# EasyEDA Pro project PCB.epro, schematic Schematic1
Board Name: Board1; Create Date: 2026-03-10; Page Name: P1; Project Name: Hyper Pi; Schematic Name: Schematic1; Update Date: 2026-03-16; Company: EasyEDA.com; Page Size: A4; Version: V1.0
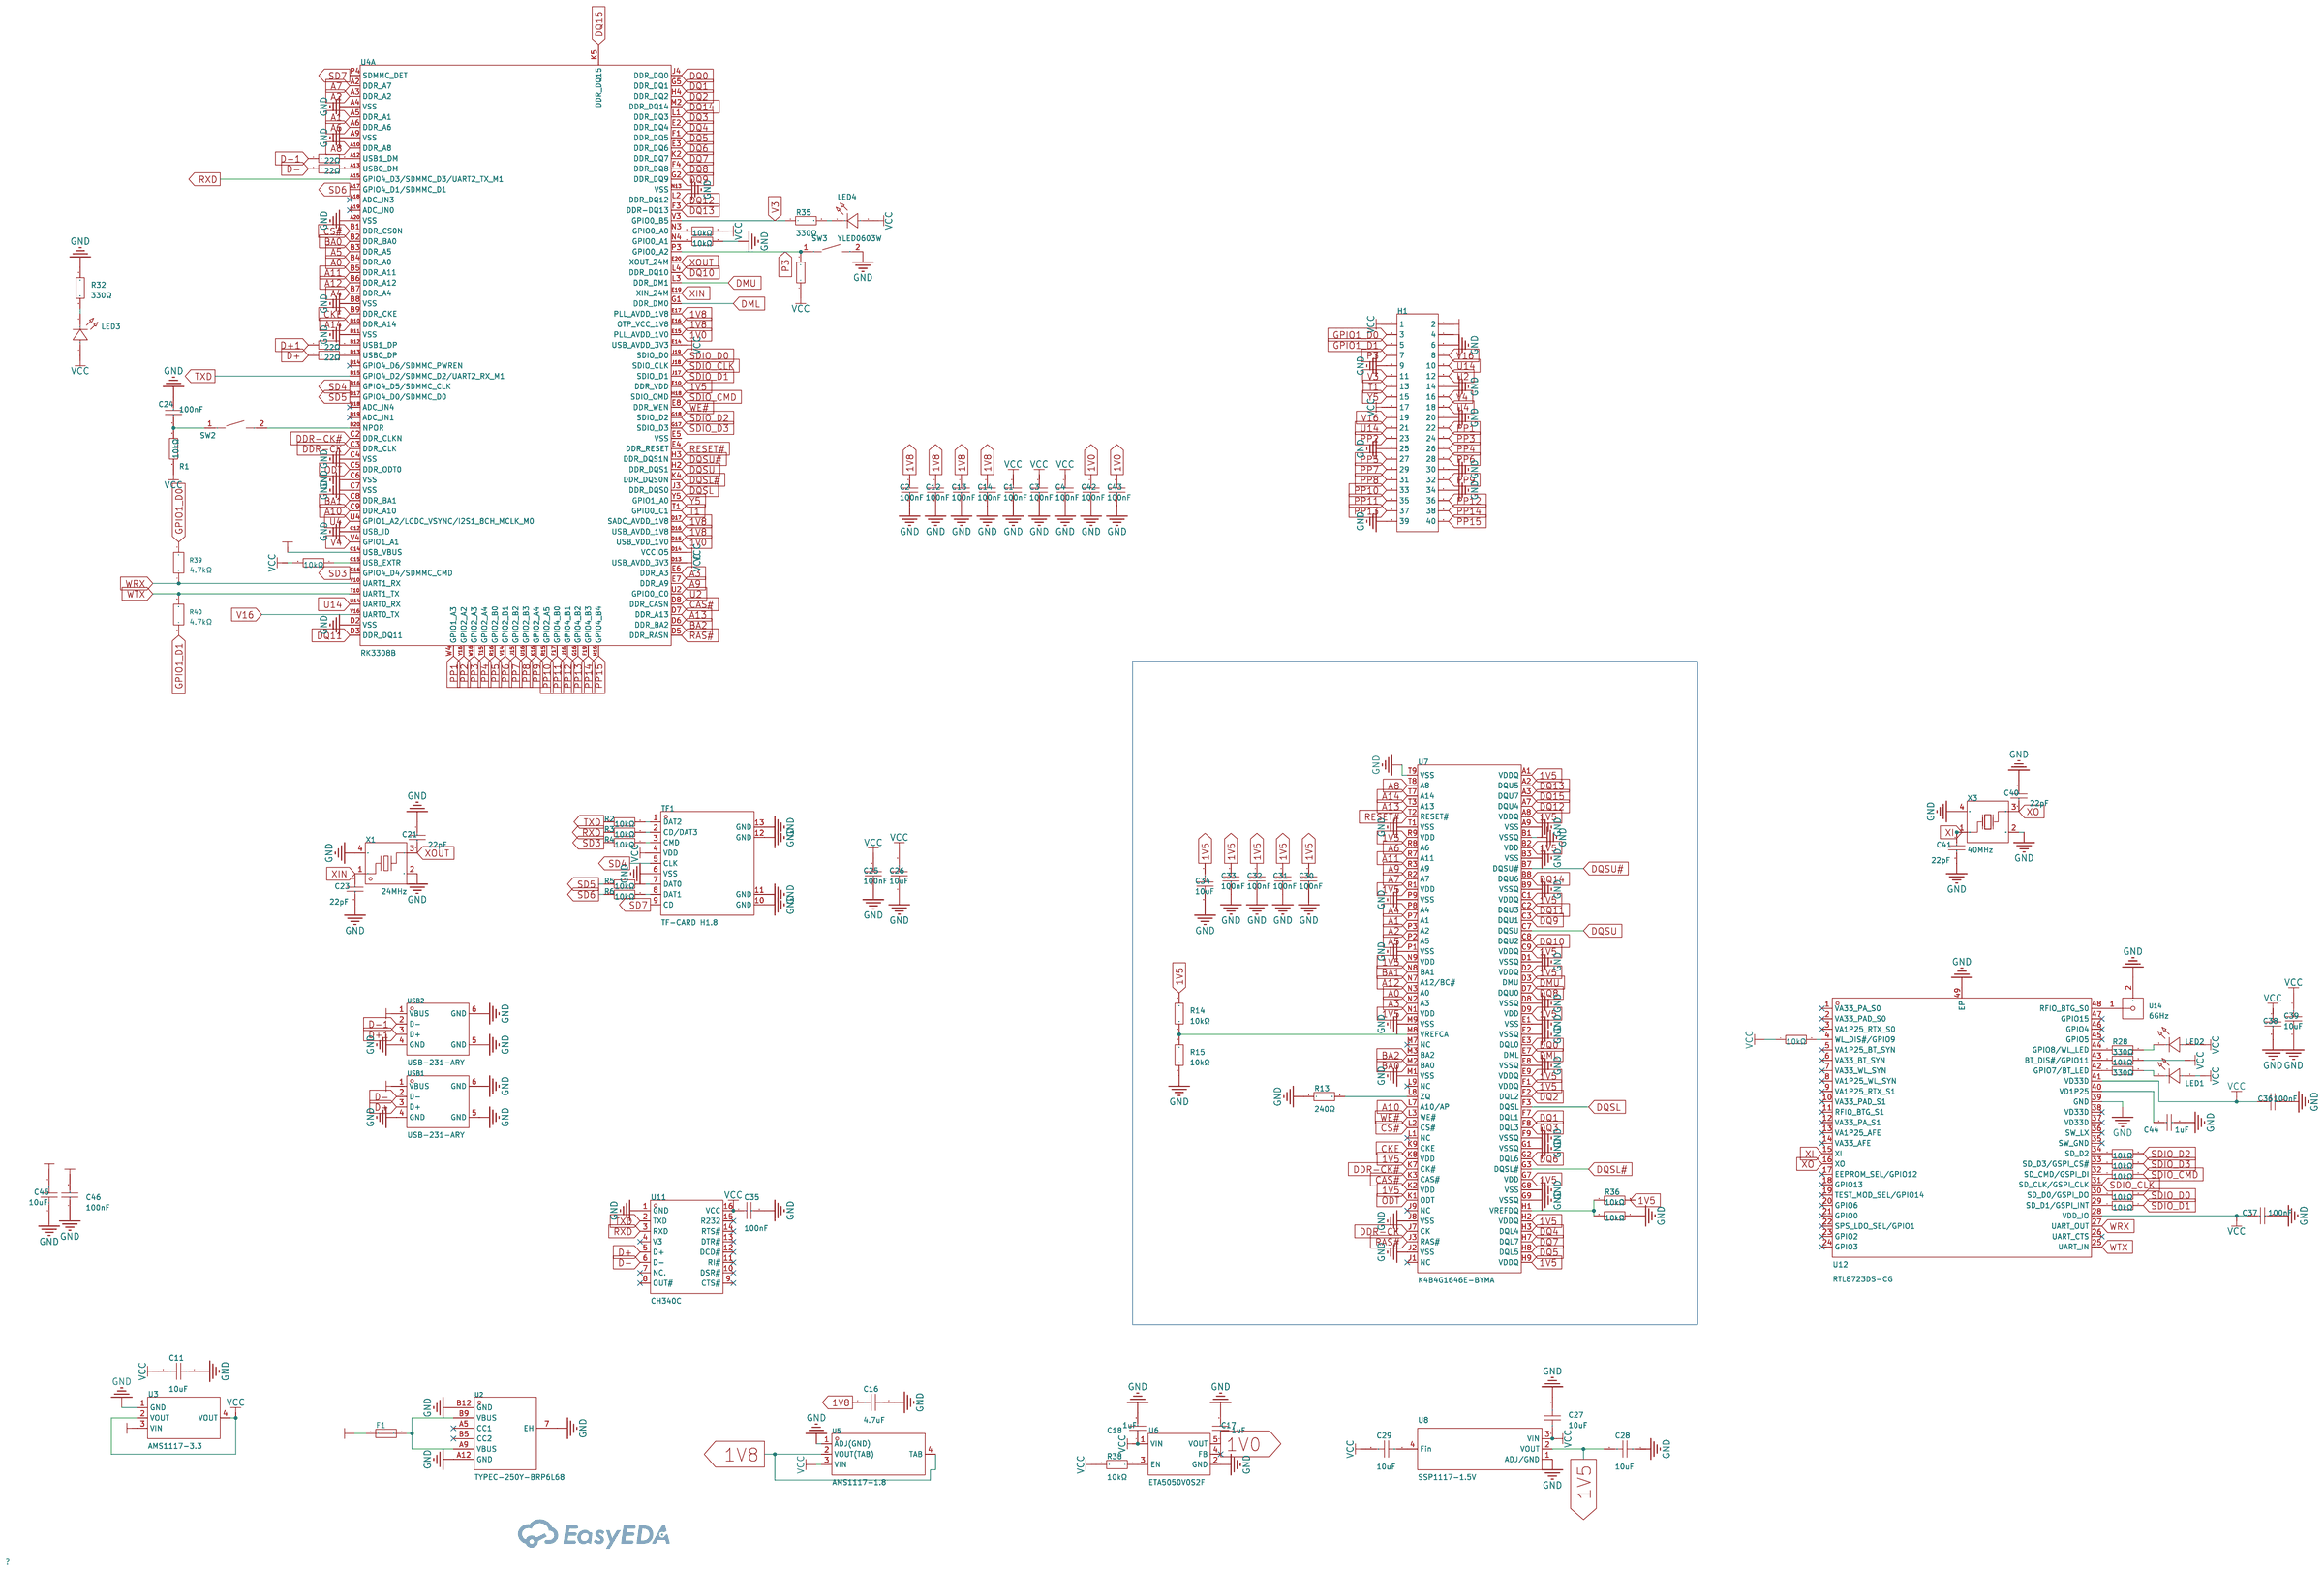
[diagram p0: schematic sheet]

## Parts
C1  100nF  [C0603]
C2  100nF  [C0603]
C3  100nF  [C0603]
C4  100nF  [C0603]
C11  10uF  [C0603]
C12  100nF  [C0603]
C13  100nF  [C0603]
C14  100nF  [C0603]
C16  4.7uF  [C0603]
C17  1uF  [C0603]
C18  1uF  [C0603]
C21  22pF  [C0603]
C23  22pF  [C0603]
C24  100nF  [C0603]
C25  100nF  [C0603]
C26  10uF  [C0603]
C27  10uF  [C0603]
C28  10uF  [C0603]
C29  10uF  [C0603]
C30  100nF  [C0603]
C31  100nF  [C0603]
C32  100nF  [C0603]
C33  100nF  [C0603]
C34  10uF  [C0603]
C35  100nF  [C0603]
C36  100nF  [C0603]
C37  100nF  [C0603]
C38  100nF  [C0603]
C39  10uF  [C0603]
C40  22pF  [C0603]
C41  22pF  [C0603]
C42  100nF  [C0603]
C43  100nF  [C0603]
C44  1uF  [C0603]
C45  10uF  [C0603]
C46  100nF  [C0603]
F1  MINISMDC050F-2  [F1812]
H1  2.54mm 2*20P直排针  [HDR-TH_40P-P2.54-V-M-R2-C20-S2.54]
LED1  XL-1608UBC-04  [LED0603-RD_BLUE]
LED2  19-219/GHC-YR2T1B5Y/3T  [LED-SMD_L1.6-W0.8_19-219-GHC-YR2T1B5Y-3T]
LED3  19-219/GHC-YR2T1B5Y/3T  [LED-SMD_L1.6-W0.8_19-219-GHC-YR2T1B5Y-3T]
LED4  YLED0603W  [LED0603-RD]
R1  10kΩ  [R0603]
R2  10kΩ  [R0603]
R3  10kΩ  [R0603]
R4  10kΩ  [R0603]
R5  10kΩ  [R0603]
R6  10kΩ  [R0603]
R13  240Ω  [R0603]
R14  10kΩ  [R0603]
R15  10kΩ  [R0603]
R17  22Ω  [R0603]
R18  22Ω  [R0603]
R19  22Ω  [R0603]
R20  22Ω  [R0603]
R21  10kΩ  [R0603]
R22  10kΩ  [R0603]
R23  10kΩ  [R0603]
R24  10kΩ  [R0603]
R25  10kΩ  [R0603]
R26  10kΩ  [R0603]
R27  10kΩ  [R0603]
R28  330Ω  [R0603]
R29  330Ω  [R0603]
R30  10kΩ  [R0603]
R31  10kΩ  [R0603]
R32  330Ω  [R0603]
R33  10kΩ  [R0603]
R34  10kΩ  [R0603]
R35  330Ω  [R0603]
R36  10kΩ  [R0603]
R37  10kΩ  [R0603]
R38  10kΩ  [R0603]
R39  4.7kΩ  [R0603]
R40  4.7kΩ  [R0603]
SW2  TS-1088-AR02016  [SW-SMD_L3.9-W3.0-P4.45]
SW3  TS-1088-AR02016  [SW-SMD_L3.9-W3.0-P4.45]
TF1  TF-CARD H1.8  [TF-SMD_TF-CARD-H1.8]
U2  TYPEC-250Y-BRP6L68  [TYPE-C-SMD_XUNPU_TYPEC-250Y-BRP6L68]
U3  AMS1117-3.3  [SOT-223-3_L6.5-W3.4-P2.30-LS7.0-BR]
U4  RK3308B  [BGA-355_L13.0-W13.0-P0.65_RK3308]  (section 1)
U5  AMS1117-1.8  [SOT-223_L6.5-W3.5-P2.30-LS7.0-BR]
U6  ETA5050V0S2F  [SOT-23-5_L3.0-W1.5-P0.95-LS2.8-BL]
U7  K4B4G1646E-BYMA  [FBGA-96_L13.5-W7.5-R16-C6-P0.80-TL]
U8  SSP1117-1.5V  [SOT-223_L6.3-W3.5-P2.30-LS7.0-BR]
U11  CH340C  [SOP-16_L10.0-W3.9-P1.27-LS6.0-BL]
U12  RTL8723DS-CG  [WQFN-48_L6.0-W6.0-P0.40-BL-EP4.2]
U14  6GHz  [IPEX-SMD_4P-L2.6-W2.6-LS3.0-1]
USB1  USB-231-ARY  [USB-A-TH_USB-231-ARY]
USB2  USB-231-ARY  [USB-A-TH_USB-231-ARY]
X1  24MHz  [CRYSTAL-SMD_4P-L3.2-W2.5-BL]
X3  40MHz  [CRYSTAL-SMD_4P-L5.0-W3.2-BL]

## Library data of the parts
C1-C4 C12-C14 C24 C25 C30-C33 C35-C38 C42 C43 C46 = CT41G-0603-2X1-50V-0.1uF-K(N): Capacitance:100nF Tolerance:±10% Tolerance:±10% Voltage Rating:50V Temperature Coefficient:-; LCSC Part Name: 100nF ±10% 50V; Supplier Part: C125205; Manufacturer: TORCH(火炬); Supplier Footprint: 0603; JLCPCB Part Class: Extended Part; Datasheet: https://item.szlcsc.com/datasheet/CT41G-0603-2X1-50V-0.1uF-K(N)/136481.html; Supplier: LCSC; Tolerance: ±10%; Voltage Rating: 50V
C11 C26-C29 C34 C39 C45 = CL10A106KP8NNNC: Capacitance:10uF Tolerance:±10% Tolerance:±10% Voltage Rating:10V Temperature Coefficient:X5R; LCSC Part Name: 10uF ±10% 10V; Supplier Part: C19702; Manufacturer: SAMSUNG(三星); Supplier Footprint: 0603; JLCPCB Part Class: Basic Part; Datasheet: https://item.szlcsc.com/datasheet/CL10A106KP8NNNC/20411.html; Supplier: LCSC; Tolerance: ±10%; Voltage Rating: 10V; Temperature Coefficient: X5R
C16 = CL10A475KO8NNNC: Capacitance:4.7uF Tolerance:±10% Tolerance:±10% Voltage Rating:16V Temperature Coefficient:X5R; LCSC Part Name: 4.7uF ±10% 16V; Supplier Part: C19666; Manufacturer: SAMSUNG(三星); Supplier Footprint: 0603; JLCPCB Part Class: Basic Part; Datasheet: https://item.szlcsc.com/datasheet/CL10A475KO8NNNC/20375.html; Supplier: LCSC; Tolerance: ±10%; Voltage Rating: 16V; Temperature Coefficient: X5R
C17 C18 C44 = CL10B105KA8NNNC: Capacitance:1uF Tolerance:±10% Tolerance:±10% Voltage Rating:25V Temperature Coefficient:X7R; LCSC Part Name: 1uF ±10% 25V; Supplier Part: C29936; Manufacturer: SAMSUNG(三星); Supplier Footprint: 0603; JLCPCB Part Class: Extended Part; Datasheet: https://item.szlcsc.com/datasheet/CL10B105KA8NNNC/30690.html; Supplier: LCSC; Tolerance: ±10%; Voltage Rating: 25V; Temperature Coefficient: X7R
C21 C23 C40 C41 = CL10C220JB8NNNC: Capacitance:22pF Tolerance:±5% Tolerance:±5% Voltage Rating:50V Temperature Coefficient:C0G; LCSC Part Name: 22pF ±5% 50V; Supplier Part: C1653; Manufacturer: SAMSUNG(三星); Supplier Footprint: 0603; JLCPCB Part Class: Basic Part; Datasheet: https://item.szlcsc.com/datasheet/CL10C220JB8NNNC/2005.html; Supplier: LCSC; Tolerance: ±5%; Voltage Rating: 50V; Temperature Coefficient: C0G
F1 = MINISMDC050F-2: Voltage - Max:24V Current - Max:100A Hold Current:1.1A Trip Current:- Power Dissipation:800mW Resistance - Initial (Ri) (Min):150mΩ Resistance - Post Trip (R1) (Max):1Ω Time to Trip(Max):1s Operating Temperature:- Operating Temperature:- Length:- Width:-; LCSC Part Name: 24V 500mA 1812自恢复; Supplier Part: C2649901; Manufacturer: Littelfuse(美国力特); Supplier Footprint: 1812; JLCPCB Part Class: Extended Part; Datasheet: https://item.szlcsc.com/datasheet/MINISMDC050F-2/2741810.html; Supplier: LCSC; Voltage - Max: 24V; Current - Max: 100A; Hold Current: 1.1A; Power Dissipation: 800mW; Resistance - Initial (Ri) (Min): 150mΩ; Resistance - Post Trip (R1) (Max): 1Ω; Time to Trip(Max): 1s
H1 = 2.54mm 2*20P直排针: Pin Structure:2x20P Pitch:2.54mm Row Spacing:2.54mm Circluar Pins/Square Pins:Pin Header Mounting Type:Through Hole Number of Rows:2 Number of Pins:40P Current Rating:3A Voltage Rating (Max):- Length of Mating Pin:6mm Insulation Height:- Length of End Con; LCSC Part Name: 2x20P 间距:2.54mm 方针 直插; Supplier Part: C50980; Manufacturer: BOOMELE(博穆精密); Supplier Footprint: 插件,P=2.54mm; JLCPCB Part Class: Extended Part; Datasheet: https://item.szlcsc.com/datasheet/2.54mm%25202*20P%25E7%259B%25B4%25E6%258E%2592%25E9%2592%2588/51992.html; Supplier: LCSC; Pin Structure: 2x20P; Pitch: 2.54mm; Row Spacing: 2.54mm; Circluar Pins/Square Pins: Pin Header; Mounting Type: Through Hole; Number of Rows: 2; Number of Pins: 40P; Current Rating: 3A; Length of Mating Pin: 6mm; Length of End Connection Pin: 3mm; Contact Material: Brass; Operating Temperature: -40℃~+105℃; Color: Black
LED1 = XL-1608UBC-04: Lamp Holder Type:- Illumination Color:Blue Voltage - Forward(Vf):3.3V Voltage - Forward(Vf):3.3V Power(Watts):70mW Forward Current:20mA Wavelength - Dominant:455nm~475nm Wavelength - Dominant:455nm~475nm Peak Wavelength:470nm Diode Configuration:Discrete; LCSC Part Name: 0603蓝色贴片式发光二极管; Supplier Part: C965807; Manufacturer: XINGLIGHT(成兴光); Supplier Footprint: 0603; Datasheet: https://item.szlcsc.com/datasheet/XL-1608UBC-04/1051416.html; Supplier: LCSC; Illumination Color: Blue; Voltage - Forward(Vf): 3.3V; Power(Watts): 70mW; Forward Current: 20mA; Wavelength - Dominant: 455nm~475nm; Peak Wavelength: 470nm; Diode Configuration: Discrete Diode; Lens Color: Water Clear; Luminous Intensity: 300mcd; Viewing Angle: 120°; Mounting Style: Top-mount; Operating Temperature: -40℃~+85℃
LED2 LED3 = 19-219/GHC-YR2T1B5Y/3T: Lamp Holder Type:- Illumination Color:Green Voltage - Forward(Vf):2.9V Voltage - Forward(Vf):2.9V Power(Watts):95mW Forward Current:5mA Wavelength - Dominant:518nm Wavelength - Dominant:518nm Peak Wavelength:525nm Diode Configuration:Discrete Diode Lens C; LCSC Part Name: 0603正贴式 绿灯(Iv=140~360mcd) @IF=20mA); Supplier Part: C2994781; Manufacturer: EVERLIGHT(亿光); Supplier Footprint: 0603; JLCPCB Part Class: Extended Part; Datasheet: https://www.everlighteurope.com/custom/files/datasheets/DSE-0006814.pdf; Supplier: LCSC; Illumination Color: Green; Voltage - Forward(Vf): 2.9V; Power(Watts): 95mW; Forward Current: 5mA; Wavelength - Dominant: 518nm; Peak Wavelength: 525nm; Diode Configuration: Discrete Diode; Lens Color: Water Clear; Luminous Intensity: 360mcd; Viewing Angle: 130°; Operating Temperature: -40℃~+85℃
LED4 = YLED0603W: Illumination Color:White Voltage - Forward(Vf):2.6V~3V Voltage - Forward(Vf):2.6V~3V Power(Watts):100mW Forward Current:- Wavelength - Dominant:- Wavelength - Dominant:- Peak Wavelength:- Diode Configuration:- Lens Color:- Color Temperature:- Color Temper; Supplier Part: C19273150; Manufacturer: YONGYUTAI(永裕泰); Supplier Footprint: 0603; Datasheet: https://item.szlcsc.com/datasheet/YLED0603W/20555404.html; Supplier: LCSC; Illumination Color: White; Voltage - Forward(Vf): 2.6V~3V; Power(Watts): 100mW; Operating Temperature: -40℃~+85℃
R1-R6 R14 R15 R21-R27 R30 R31 R33 R34 R36-R38 = RC0603FR-0710KL: Type:Thick Film Resistors Resistance: Tolerance:±1% Tolerance:±1% Power(Watts): Overload Voltage (Max): Temperature Coefficient:±100ppm/℃ Temperature Coefficient:±100ppm/℃ Operating Temperature Range:-55℃~+155℃ Operating Temperature Range:-55℃~+155℃; LCSC Part Name: 厚膜电阻 10kΩ ±1% 100mW; Supplier Part: C98220; Manufacturer: YAGEO(国巨); Supplier Footprint: 0603; JLCPCB Part Class: Extended Part; Datasheet: https://atta.szlcsc.com/upload/public/pdf/source/20180927/C295883_E8D83085EA81BD7DE0B2B681138C15EE.pdf; Supplier: LCSC; Type: Thick Film Resistors; Tolerance: ±1%; Temperature Coefficient: ±100ppm/℃; Operating Temperature Range: -55℃~+155℃
R13 = RC0603FR-07240RL: Type:Thick Film Resistors Resistance: Tolerance:±1% Tolerance:±1% Power(Watts): Overload Voltage (Max): Temperature Coefficient:±100ppm/℃ Temperature Coefficient:±100ppm/℃ Operating Temperature Range:-55℃~+155℃ Operating Temperature Range:-55℃~+155℃; LCSC Part Name: 厚膜电阻 240Ω ±1% 100mW; Supplier Part: C114613; Manufacturer: YAGEO(国巨); Supplier Footprint: 0603; JLCPCB Part Class: Extended Part; Datasheet: https://atta.szlcsc.com/upload/public/pdf/source/20180821/C275644_0D56F95EFF785E7D9A1FEF436B37DA78.pdf; Supplier: LCSC; Type: Thick Film Resistors; Tolerance: ±1%; Temperature Coefficient: ±100ppm/℃; Operating Temperature Range: -55℃~+155℃
R17-R20 = 0603WAF220JT5E: Type:Thick Film Resistors Resistance:22Ω Tolerance:±1% Tolerance:±1% Power(Watts): Overload Voltage (Max): Temperature Coefficient:±100ppm/℃ Temperature Coefficient:±100ppm/℃ Operating Temperature Range:-55℃~+155℃ Operating Temperature Range:-55℃~+155℃; LCSC Part Name: 22Ω ±1% 100mW 厚膜电阻; Supplier Part: C23345; Manufacturer: UNI-ROYAL(厚声); Supplier Footprint: 0603; JLCPCB Part Class: Basic Part; Datasheet: https://atta.szlcsc.com/upload/public/pdf/source/20200306/C422600_1E6D84923E4A46A82E41ADD87F860B5C.pdf; Supplier: LCSC; Type: Thick Film Resistors; Tolerance: ±1%; Temperature Coefficient: ±100ppm/℃; Operating Temperature Range: -55℃~+155℃
R28 R29 R32 R35 = RC0603FR-07330RL: Type:Thick Film Resistors Resistance: Tolerance:±1% Tolerance:±1% Power(Watts): Overload Voltage (Max): Temperature Coefficient:±100ppm/℃ Temperature Coefficient:±100ppm/℃ Operating Temperature Range:-55℃~+155℃ Operating Temperature Range:-55℃~+155℃; LCSC Part Name: 厚膜电阻 330Ω ±1% 100mW; Supplier Part: C105881; Manufacturer: YAGEO(国巨); Supplier Footprint: 0603; JLCPCB Part Class: Extended Part; Datasheet: https://atta.szlcsc.com/upload/public/pdf/source/20180821/C275644_0D56F95EFF785E7D9A1FEF436B37DA78.pdf; Supplier: LCSC; Type: Thick Film Resistors; Tolerance: ±1%; Temperature Coefficient: ±100ppm/℃; Operating Temperature Range: -55℃~+155℃
R39 R40 = HoLTT0603-1/10W-4.7K-1%: Type:Thick Film Resistor Resistance:4.7kΩ Tolerance:±1% Tolerance:±1% Power(Watts):100mW Voltage-Supply(Max):75V Temperature Coefficient:±100ppm/℃ Temperature Coefficient:±100ppm/℃ Operating Temperature:-55℃~+155℃ Operating Temperature:-55℃~+155℃; LCSC Part Name: 4.7kΩ ±1% 100mW; Supplier Part: C2904521; Manufacturer: Milliohm(毫欧); Supplier Footprint: 0603; JLCPCB Part Class: Extended Part; Datasheet: https://item.szlcsc.com/datasheet/HoLTT0603-1%252F10W-4.7K-1%2525/3164221.html; Supplier: LCSC; Type: Thick Film Resistor; Tolerance: ±1%; Power(Watts): 100mW; Voltage-Supply(Max): 75V; Temperature Coefficient: ±100ppm/℃; Operating Temperature: -55℃~+155℃
SW2 SW3 = TS-1088-AR02016: Circuit:SPST Actuator Style:Round Button Operating Force:1.6N Mounting Type:Surface Mount,Vertical Length:4mm Width:3mm Switch Height:2mm with Bracket:Without Bracket Contact Current:50mA Voltage Rating:12V Actuator/Cap Color:Black Termination Style:SMD(S; LCSC Part Name: 4*3*2mm 立贴 轻触开关; Supplier Part: C720477; Manufacturer: XUNPU(讯普); Supplier Footprint: SMD,4x3mm; JLCPCB Part Class: Basic Part; Datasheet: https://item.szlcsc.com/datasheet/TS-1088-AR02016/763484.html; Supplier: LCSC; Circuit: SPST; Actuator Style: Round Button; Operating Force: 1.6N; Mounting Type: Surface Mount,Vertical; Length: 4mm; Width: 3mm; Switch Height: 2mm; with Bracket: Without Bracket; Contact Current: 50mA; Voltage Rating: 12V; Actuator/Cap Color: Black; Termination Style: SMD(SMT) Tab; Life: 100,000 Cycles; Operating Temperature: -30℃~+80℃
TF1 = TF-CARD H1.8: Card Connection Mode:Push-Push Card Type:MicroSD Card (TF Card) Connector Type:Connector and Ejector Additional Card Detection Pins:- Supplementary Features:- Height Above Board:1.8mm Operating Temperature:-40℃~+70℃ Operating Temperature:-40℃~+70℃; LCSC Part Name: 9P，自弹式TF卡座; Supplier Part: C7529389; Manufacturer: SHOU HAN(首韩); Supplier Footprint: SMD; Datasheet: https://item.szlcsc.com/datasheet/TF-CARD%2520H1.8/8629776.html; Supplier: LCSC; Card Connection Mode: Push-Push; Card Type: MicroSD Card (TF Card); Connector Type: Connector and Ejector; Height Above Board: 1.8mm; Operating Temperature: -40℃~+70℃
U2 = TYPEC-250Y-BRP6L68: Connector Type:Type-C Protocol Standard:- Gender:Female Mounting Type:Surface Mount, Right Angle Number of Contacts:- Number of Ports:1 Current Rating-Power:5A Voltage Rating:20V Connect-Disconnect Life:3,000 Cycles Length:6.65mm Detection color:Black Ope; LCSC Part Name: Type-C 母 卧贴; Supplier Part: C5252714; Manufacturer: XUNPU(讯普); Supplier Footprint: SMD; JLCPCB Part Class: Extended Part; Datasheet: https://item.szlcsc.com/datasheet/TYPEC-250Y-BRP6L68/5970703.html; Supplier: LCSC; Connector Type: Type-C; Gender: Female; Mounting Type: Surface Mount, Right Angle; Number of Ports: 1; Current Rating-Power: 5A; Voltage Rating: 20V; Connect-Disconnect Life: 3,000 Cycles; Length: 6.65mm; Detection color: Black; Operating Temperature: -40℃~+85℃
U3 = AMS1117-3.3_C6186: Output Type:Fixed Voltage - Supply:16V Output Voltage:3.3V Output Voltage:3.3V Output Current:1A Power Supply Rejection Ratio (PSRR):72dB@(120Hz) Voltage Dropout:1.1V@(800mA) standby current:5mA Noise:0.003%Vout Features:Over Current Protection；Over Tempe; LCSC Part Name: 输出3.3V 1A; Supplier Part: C6186; Manufacturer: AMS; Supplier Footprint: SOT-223; JLCPCB Part Class: Basic Part; Datasheet: https://item.szlcsc.com/datasheet/AMS1117-3.3/6652.html; Supplier: LCSC; Output Type: Fixed; Voltage - Supply: 16V; Output Voltage: 3.3V; Output Current: 1A; Power Supply Rejection Ratio (PSRR): 72dB@(120Hz); Voltage Dropout: 1.1V@(800mA); standby current: 5mA; Noise: 0.003%Vout; Features: Over Current Protection；Over Temperature Protection; Operating Temperature: -40℃~+125℃; Output Configuration: Positive; Number of Outputs: 1
U4 = RK3308B: Supplier Part: C22447822; Manufacturer: Rockchip(瑞芯微); Supplier Footprint: TFBGA-355; JLCPCB Part Class: Extended Part; Datasheet: https://item.szlcsc.com/datasheet/RK3308B/24105951.html; Supplier: LCSC
U5 = AMS1117-1.8_C2891837: Output Type:Fixed Voltage - Supply:12V Output Voltage:1.8V Output Voltage:1.8V Output Current:1A Power Supply Rejection Ratio (PSRR):60dB@(120Hz) Voltage Dropout:1.3V@(1A) standby current:5mA Noise:0.005%Vout Features:Over Current Protection；Over Temperat; LCSC Part Name: 输入18V 输出1.8V 1A; Supplier Part: C2891837; Manufacturer: YONGYUTAI(永裕泰); Supplier Footprint: SOT-223; JLCPCB Part Class: Extended Part; Datasheet: https://item.szlcsc.com/datasheet/AMS1117-1.8/3119756.html; Supplier: LCSC; Output Type: Fixed; Voltage - Supply: 12V; Output Voltage: 1.8V; Output Current: 1A; Power Supply Rejection Ratio (PSRR): 60dB@(120Hz); Voltage Dropout: 1.3V@(1A); standby current: 5mA; Noise: 0.005%Vout; Features: Over Current Protection；Over Temperature Protection; Operating Temperature: -40℃~+125℃@(Tj); Output Configuration: Positive; Number of Outputs: 1
U6 = ETA5050V0S2F: Output Type:Fixed Voltage - Supply:6V Output Voltage:1V Output Voltage:1V Output Current:500mA Power Supply Rejection Ratio (PSRR):73dB@(100Hz) Voltage Dropout:- standby current:37uA Noise:50uVrms Features:Short Circuit Protection；Over Temperature Protect; LCSC Part Name: 1V 500mA 6V; Supplier Part: C7436029; Manufacturer: ETA(钰泰); Supplier Footprint: SOT23-5; JLCPCB Part Class: Extended Part; Datasheet: https://item.szlcsc.com/datasheet/ETA5050V0S2F/8453546.html; Supplier: LCSC; Output Type: Fixed; Voltage - Supply: 6V; Output Voltage: 1V; Output Current: 500mA; Power Supply Rejection Ratio (PSRR): 73dB@(100Hz); standby current: 37uA; Noise: 50uVrms; Features: Short Circuit Protection；Over Temperature Protection；Over Current Protection；Enable; Operating Temperature: -40℃~+85℃; Output Configuration: Positive; Number of Outputs: 1
U7 = K4B4G1646E-BYMA_C500275: Memory Format:DDR3L SDRAM Clock Frequency:933MHz Memory Size:4Gbit Voltage - Supply:1.28V~1.45V Voltage - Supply:1.28V~1.45V Current - Supply:- Refresh Current:- Operating Temperature:-40℃~+95℃ Operating Temperature:-40℃~+95℃; LCSC Part Name: 4Gb E型裸片，x16 DDR3L SDRAM; Supplier Part: C500275; Manufacturer: SAMSUNG(三星半导体); Supplier Footprint: FBGA-96(7.5x13.3); Datasheet: https://item.szlcsc.com/datasheet/K4B4G1646E-BYMA/512623.html; Supplier: LCSC; Memory Format: DDR3L SDRAM; Clock Frequency: 933MHz; Memory Size: 4Gbit; Voltage - Supply: 1.28V~1.45V; Operating Temperature: -40℃~+95℃
U8 = SSP1117-1.5V: Output Type:Fixed Voltage - Supply:20V Output Voltage:1.5V Output Voltage:1.5V Output Current:1A Power Supply Rejection Ratio (PSRR):- Voltage Dropout:1.3V@(1A) Features:Over Temperature Protection Operating Temperature:-40℃~+85℃ Operating Temperature:-40; LCSC Part Name: 1.5V 1A 20V; Supplier Part: C308941; Manufacturer: Siproin(上海矽朋); Supplier Footprint: SOT-223; JLCPCB Part Class: Extended Part; Datasheet: https://item.szlcsc.com/datasheet/SSP1117-1.5V/292648.html; Supplier: LCSC; Output Type: Fixed; Voltage - Supply: 20V; Output Voltage: 1.5V; Output Current: 1A; Voltage Dropout: 1.3V@(1A); Features: Over Temperature Protection; Operating Temperature: -40℃~+85℃; Output Configuration: Positive; Number of Outputs: 1
U11 = CH340C: Applications Function:Transceiver USB Protocol:USB 2.0 Voltage - Supply:3.3V；5V Voltage - Supply:3.3V；5V Data Rate:2Mbps Operating Temperature:-20℃~+70℃ Operating Temperature:-20℃~+70℃ Current - Supply:7mA Supply Current (Iq):50uA; LCSC Part Name: USB转串口芯片; Supplier Part: C84681; Manufacturer: WCH(南京沁恒); Supplier Footprint: SOP-16; JLCPCB Part Class: Extended Part; Datasheet: https://item.szlcsc.com/datasheet/CH340C/85852.html; Supplier: LCSC; Applications Function: Transceiver; USB Protocol: USB 2.0; Voltage - Supply: 3.3V；5V; Data Rate: 2Mbps; Operating Temperature: -20℃~+70℃; Current - Supply: 7mA; Supply Current (Iq): 50uA
U12 = RTL8723DS-CG: Frequency Range:2400MHz~2483.5MHz Frequency Range:2400MHz~2483.5MHz Interface:GPIO；PCM；UART；SPI Operating Voltage:3V~3.6V Operating Voltage:3V~3.6V Applications:WiFi；Bluetooth Data Rate:150Mbps Typical Application Frequency:2450MHz Operating Temperature:0; Supplier Part: C2762334; Manufacturer: REALTEK(瑞昱); Supplier Footprint: WQFN-48-EP(6x6); JLCPCB Part Class: Extended Part; Datasheet: https://atta.szlcsc.com/upload/public/pdf/source/20240905/58802A97879605D6EBE218F35C750A08.pdf; Supplier: LCSC; Frequency Range: 2400MHz~2483.5MHz; Interface: GPIO；PCM；UART；SPI; Operating Voltage: 3V~3.6V; Applications: WiFi；Bluetooth; Data Rate: 150Mbps; Typical Application Frequency: 2450MHz; Operating Temperature: 0℃~+70℃
U14 = RF-IPEX03-01: Connector Type:Board Side Interface:Male Pin Number of Ports:1 Interface Diameter:2mm Interface Length/Height:1.25mm Frequency:6GHz RF Series:IPEX Impedance:50Ω; LCSC Part Name: 内针 IPEX; Supplier Part: C4749207; Manufacturer: DEALON(德艺隆); Supplier Footprint: SMD; JLCPCB Part Class: Extended Part; Datasheet: https://item.szlcsc.com/datasheet/RF-IPEX03-01/5322103.html; Supplier: LCSC; Connector Type: Board Side; Interface: Male Pin; Number of Ports: 1; Interface Diameter: 2mm; Interface Length/Height: 1.25mm; RF Series: IPEX; Impedance: 50Ω
USB1 USB2 = USB-231-ARY: Connector Type:Type-A Protocol Standard:USB 2.0 Gender:Female Mounting Type:Right Angle Number of Contacts:4P Number of Ports:1 Current Rating-Power:1.5A Voltage Rating:30V Length:14.2mm Detection color:White Operating Temperature:-20℃~+70℃ Operating Temp; LCSC Part Name: Type-A 母 弯插; Supplier Part: C720525; Manufacturer: XUNPU(讯普); Supplier Footprint: 弯插; JLCPCB Part Class: Extended Part; Datasheet: https://item.szlcsc.com/datasheet/USB-231-ARY/763532.html; Supplier: LCSC; Connector Type: Type-A; Protocol Standard: USB 2.0; Gender: Female; Mounting Type: Right Angle; Number of Contacts: 4P; Number of Ports: 1; Current Rating-Power: 1.5A; Voltage Rating: 30V; Length: 14.2mm; Detection color: White; Operating Temperature: -20℃~+70℃
X1 = XL2EL89COI-111YLC-24M: Type:Crystal Oscillator Frequency:24MHz Normal temperature Frequency Tolerance:±10ppm Normal temperature Frequency Tolerance:±10ppm Load Capacitance:12pF Frequency Stability:±20ppm Frequency Stability:±20ppm Operating Temperature:-40℃~+85℃ Operating Tempe; LCSC Part Name: YSX321SL 24MHZ 4P 3225 12PF ±10PPM -40~85℃ (±20PPM); Supplier Part: C5444545; Manufacturer: YXC(扬兴晶振); Supplier Footprint: SMD3225-4P; JLCPCB Part Class: Extended Part; Datasheet: https://item.szlcsc.com/datasheet/XL2EL89COI-111YLC-24M/6336541.html; Supplier: LCSC; Type: Crystal Oscillator; Normal temperature Frequency Tolerance: ±10ppm; Load Capacitance: 12pF; Frequency Stability: ±20ppm; Operating Temperature: -40℃~+85℃
X3 = XVHEELNANF-40MHZ: Type:Crystal Oscillator Frequency:40MHz Normal temperature Frequency Tolerance:±30ppm Normal temperature Frequency Tolerance:±30ppm Load Capacitance:20pF Frequency Stability:±30ppm Frequency Stability:±30ppm Operating Temperature:-40℃~+85℃ Operating Tempe; LCSC Part Name: 40MHz ±30ppm 20pF; Supplier Part: C295530; Manufacturer: TAITIEN(泰艺电子); Supplier Footprint: SMD5032-4P; JLCPCB Part Class: Extended Part; Datasheet: https://item.szlcsc.com/datasheet/XVHEELNANF-40MHZ/279959.html; Supplier: LCSC; Type: Crystal Oscillator; Normal temperature Frequency Tolerance: ±30ppm; Load Capacitance: 20pF; Frequency Stability: ±30ppm; Operating Temperature: -40℃~+85℃

## Nets
1V0: C17.1 C42.1 C43.1 U4.D15(USB_VDD_1V0) U4.E15(PLL_AVDD_1V0) U6.5(VOUT)
1V5: C28.2 C30.1 C31.1 C32.1 C33.1 C34.1 R14.1 R36.2 U4.E10(DDR_VDD) U7.A1(VDDQ) U7.A8(VDDQ) U7.B2(VDD) U7.C1(VDDQ) U7.C9(VDDQ) U7.D2(VDDQ) U7.D9(VDD) U7.E9(VDDQ) U7.F1(VDDQ) U7.G7(VDD) U7.H2(VDDQ) U7.H9(VDDQ) U7.K2(VDD) U7.K8(VDD) U7.N1(VDD) U7.N9(VDD) U7.R1(VDD) U7.R9(VDD) U8.2(VOUT)
1V8: C2.1 C12.1 C13.1 C14.1 C16.1 U4.D16(USB_AVDD_1V8) U4.D17(SADC_AVDD_1V8) U4.E16(OTP_VCC_1V8) U4.E17(PLL_AVDD_1V8) U5.2(VOUT(TAB)) U5.4(TAB)
+5V: F1.2 U2.A9(VBUS) U2.B9(VBUS)
GND: C1.2 C2.2 C3.2 C4.2 C11.1 C12.2 C13.2 C14.2 C16.2 C17.2 C18.2 C21.1 C23.2 C24.1 C25.2 C26.1 C27.1 C28.1 C30.2 C31.2 C32.2 C33.2 C34.2 C35.2 C36.2 C37.2 C38.2 C39.2 C40.1 C41.2 C42.2 C43.2 C44.1 C45.2 C46.1 H1.6 H1.9 H1.14 H1.20 H1.25 H1.30 H1.34 H1.39 R13.1 R15.1 R31.1 R32.1 R37.1 SW3.2 TF1.6(VSS) TF1.10(GND) TF1.11(GND) TF1.12(GND) TF1.13(GND) U2.7(EH) U2.A12(GND) U2.B12(GND) U3.1(GND) U4.A4(VSS) U4.A9(VSS) U4.A20(VSS) U4.B8(VSS) U4.B11(VSS) U4.C4(VSS) U4.C6(VSS) U4.C7(VSS) U4.C12(USB_ID) U4.D2(VSS) U4.N13(VSS) U5.1(ADJ(GND)) U6.2(GND) U7.A9(VSS) U7.B1(VSSQ) U7.B3(VSS) U7.B9(VSSQ) U7.D1(VSSQ) U7.D8(VSSQ) U7.E1(VSS) U7.E2(VSSQ) U7.E8(VSSQ) U7.F9(VSSQ) U7.G1(VSSQ) U7.G8(VSS) U7.G9(VSSQ) U7.J2(VSS) U7.J8(VSS) U7.M1(VSS) U7.M9(VSS) U7.P1(VSS) U7.P9(VSS) U7.T1(VSS) U7.T9(VSS) U8.1(ADJ/GND) U11.1(GND) U12.39(GND) U12.49(EP) U14.2 USB1.4(GND) USB1.5(GND) USB1.6(GND) USB2.4(GND) USB2.5(GND) USB2.6(GND) X1.2(GND) X1.4(GND) X3.2(GND) X3.4(GND)
V3: H1.11 R35.1 U4.V3(GPIO0_B5)
V4: H1.16 U4.V4(GPIO1_A1)
V16: H1.8 H1.19 U4.V16(UART0_TX)
VBUS: C45.1 C46.2 F1.1 H1.2 H1.4 U3.3(VIN) U4.C14(USB_VBUS) USB1.1(VBUS) USB2.1(VBUS)
VCC: C1.1 C3.1 C4.1 C11.2 C18.1 C25.1 C26.2 C27.2 C29.2 C35.1 C36.1 C37.1 C38.1 C39.1 H1.1 H1.17 LED1.2(A) LED2.1(A) LED3.1(A) LED4.2(A) R1.1 R26.1 R27.2 R30.1 R33.2 R34.1 R38.2 TF1.4(VDD) U3.2(VOUT) U3.4(VOUT) U4.D13(USB_AVDD_3V3) U4.D14(VCCIO5) U4.E14(USB_AVDD_3V3) U5.3(VIN) U6.1(VIN) U8.3(VIN) U11.16(VCC) U12.28(VDD_IO) U12.41(VD33D)
A0: U4.B4(DDR_A0) U7.N3(A0)
A1: U4.A5(DDR_A1) U7.P7(A1)
A2: U4.A3(DDR_A2) U7.P3(A2)
A3: U4.E6(DDR_A3) U7.N2(A3)
A4: U4.B7(DDR_A4) U7.P8(A4)
A5: U4.B3(DDR_A5) U7.P2(A5)
A6: U4.A6(DDR) U7.R8(A6)
A7: U4.A2(DDR_A7) U7.R2(A7)
A8: U4.A10(DDR_A8) U7.T8(A8)
A9: U4.E7(DDR_A9) U7.R3(A9)
A10: U4.C9(DDR_A10) U7.L7(A10/AP)
A11: U4.B5(DDR_A11) U7.R7(A11)
A12: U4.B6(DDR_A12) U7.N7(A12/BC#)
A13: U4.D7(DDR_A13) U7.T3(A13)
A14: U4.B10(DDR_A14) U7.T7(A14)
BA0: U4.B2(DDR_BA0) U7.M2(BA0)
BA1: U4.C8(DDR_BA1) U7.N8(BA1)
BA2: U4.D6(DDR_BA2) U7.M3(BA2)
CAS#: U4.D8(DDR_CASN) U7.K3(CAS#)
CKE: U4.B9(DDR_CKE) U7.K9(CKE)
CS#: U4.B1(DDR_CS0N) U7.L2(CS#)
D+: R17.1 U11.5(D+) USB1.3(D+)
D+1: R18.1 USB2.3(D+)
D-: R19.1 U11.6(D-) USB1.2(D-)
D-1: R20.1 USB2.2(D-)
DDR-CK: U4.C3(DDR_CLK) U7.J7(CK)
DDR-CK#: U4.C2(DDR_CLKN) U7.K7(CK#)
DML: U4.G1(DDR_DM0) U7.E7(DML)
DMU: U4.L3(DDR_DM1) U7.D3(DMU)
DQ0: U4.J4(DDR_DQ0) U7.E3(DQL0)
DQ1: U4.G5(DDR_DQ1) U7.F7(DQL1)
DQ2: U4.H4(DDR_DQ2) U7.F2(DQL2)
DQ3: U4.L1(DDR_DQ3) U7.F8(DQL3)
DQ4: U4.E2(DDR_DQ4) U7.H3(DQL4)
DQ5: U4.F1(DDR_DQ5) U7.H8(DQL5)
DQ6: U4.E3(DDR_DQ6) U7.G2(DQL6)
DQ7: U4.K2(DDR_DQ7) U7.H7(DQL7)
DQ8: U4.F4(DDR_DQ8) U7.D7(DQU0)
DQ9: U4.G2(DDR_DQ9) U7.C3(DQU1)
DQ10: U4.L4(DDR_DQ10) U7.C8(DQU2)
DQ11: U4.D3(DDR_DQ11) U7.C2(DQU3)
DQ12: U4.L2(DDR_DQ12) U7.A7(DQU4)
DQ13: U4.F3(DDR-DQ13) U7.A2(DQU5)
DQ14: U4.M2(DDR_DQ14) U7.B8(DQU6)
DQ15: U4.K5(DDR_DQ15) U7.A3(DQU7)
DQSL: U4.J3(DDR_DQS0) U7.F3(DQSL)
DQSL#: U4.K4(DDR_DQS0N) U7.G3(DQSL#)
DQSU: U4.H2(DDR_DQS1) U7.C7(DQSU)
DQSU#: U4.H3(DDR_DQS1N) U7.B7(DQSU#)
GPIO1_D0: H1.3 R39.2
GPIO1_D1: H1.5 R40.1
ODT: U4.C5(DDR_ODT0) U7.K1(ODT)
P3: H1.7 R34.2 SW3.1 U4.P3(GPIO0_A2)
PP1: H1.22 U4.W4(GPIO1_A3)
PP2: H1.23 U4.Y16(GPIO2_A2)
PP3: H1.24 U4.W16(GPIO2_A3)
PP4: H1.26 U4.T15(GPIO2_A4)
PP5: H1.27 U4.R16(GPIO2_B0)
PP6: H1.28 U4.V14(GPIO2_B1)
PP7: H1.29 U4.J15(GPIO2_B2)
PP8: H1.31 U4.U16(GPIO2_B3)
PP9: H1.32 U4.K16(GPIO2_A4)
PP10: H1.33 U4.R15(GPIO2_A5)
PP11: H1.35 U4.F17(GPIO4_B0)
PP12: H1.36 U4.J16(GPIO4_B1)
PP13: H1.37 U4.G16(GPIO4_B2)
PP14: H1.38 U4.F19(GPIO4_B3)
PP15: H1.40 U4.H16(GPIO4_B4)
RAS#: U4.D5(DDR_RASN) U7.J3(RAS#)
RESET#: U4.E4(DDR_RESET) U7.T2(RESET#)
RXD: R3.1 U4.A15(GPIO4_D3/SDMMC_D3/UART2_TX_M1) U11.3(RXD)
SD3: R4.1 U4.C16(GPIO4_D4/SDMMC_CMD)
SD4: TF1.5(CLK) U4.B16(GPIO4_D5/SDMMC_CLK)
SD5: R5.1 U4.B17(GPIO4_D0/SDMMC_D0)
SD6: R6.1 U4.A17(GPIO4_D1/SDMMC_D1)
SD7: TF1.9(CD) U4.P4(SDMMC_DET)
SDIO_CLK: U4.J18(SDIO_CLK) U12.31(SD_CLK/GSPI_CLK)
SDIO_CMD: R21.2 U4.H18(SDIO_CMD)
SDIO_D0: R22.2 U4.J19(SDIO_D0)
SDIO_D1: R23.2 U4.J17(SDIO_D1)
SDIO_D2: R25.2 U4.G18(SDIO_D2)
SDIO_D3: R24.2 U4.G17(SDIO_D3)
T1: H1.13 U4.T1(GPIO0_C1)
TXD: R2.1 U4.B15(GPIO4_D2/SDMMC_D2/UART2_RX_M1) U11.2(TXD)
U2: H1.12 U4.U2(GPIO0_C0)
U4: H1.18 U4.U4(GPIO1_A2/LCDC_VSYNC/I2S1_8CH_MCLK_M0)
U14: H1.10 H1.21 U4.U14(UART0_RX)
WE#: U4.E8(DDR_WEN) U7.L3(WE#)
WRX: R39.1 U4.V10(UART1_RX) U12.27(UART_OUT)
WTX: R40.2 U4.T10(UART1_TX) U12.25(UART_IN)
XI: C41.1 U12.15(XI) X3.1(OSC1)
XIN: C23.1 U4.E19(XIN_24M) X1.1
XO: C40.2 U12.16(XO) X3.3(OSC2)
XOUT: C21.2 U4.E20(XOUT_24M) X1.3
Y5: H1.15 U4.Y5(GPIO1_A0)
$1N10142: R2.2 TF1.1(DAT2)
$1N10185: R3.2 TF1.2(CD/DAT3)
$1N10228: R4.2 TF1.3(CMD)
$1N10271: R5.2 TF1.7(DAT0)
$1N10314: R6.2 TF1.8(DAT1)
$1N14120: C29.1 U8.4(Fin)
$1N27095: R13.2 U7.L8(ZQ)
$1N27705: R14.2 R15.2 U7.M8(VREFCA)
$1N29645: R17.2 U4.B13(USB0_DP)
$1N29684: R18.2 U4.B12(USB1_DP)
$1N29723: R19.2 U4.A13(USB0_DM)
$1N29762: R20.2 U4.A12(USB1_DM)
$1N33959: R21.1 U12.32(SD_CMD/GSPI_DI)
$1N33998: R22.1 U12.30(SD_D0/GSPI_DO)
$1N34037: R23.1 U12.29(SD_D1/GSPI_INT)
$1N34076: R24.1 U12.33(SD_D3/GSPI_CS#)
$1N36646: R25.1 U12.34(SD_D2)
$1N40142: R26.2 U12.4(WL_DIS#/GPIO9)
$1N40260: U12.48(RFIO_BTG_S0) U14.1
$1N42864: R27.1 U12.43(BT_DIS#/GPIO11)
$1N43059: R28.1 U12.44(GPIO8/WL_LED)
$1N43166: R29.1 U12.42(GPIO7/BT_LED)
$1N43323: C44.2 U12.40(VD1P25)
$1N47046: LED2.2(K) R28.2
$1N47049: LED1.1(K) R29.2
$1N48310: C24.2 R1.2 SW2.1
$1N48313: SW2.2 U4.B20(NPOR)
$1N51444: R30.2 U4.N3(GPIO0_A0)
$1N51483: R31.2 U4.N4(GPIO0_A1)
$1N51672: LED3.2(K) R32.2
$1N52332: R33.1 U4.C15(USB_EXTR)
$1N59229: LED4.1(K) R35.2
$1N59832: R36.1 R37.2 U7.H1(VREFDQ)
$1N60456: R38.1 U6.3(EN)

Not connected (* = marked no-connect by the designer): U2 A5(CC1)* B5(CC2)*; U4 A18(ADC_IN3)* A19(ADC_IN0)* B14(GPIO4_D6/SDMMC_PWREN)* B18(ADC_IN4)* B19(ADC_IN1)* E5(VSS); U6 4(FB)*; U7 J1(NC)* J9(NC)* L1(NC)* L9(NC)* M7(NC)*; U11 4(V3)* 7(NC.)* 8(OUT#)* 9(CTS#)* 10(DSR#)* 11(RI#)* 12(DCD#)* 13(DTR#)* 14(RTS#)* 15(R232)*; U12 1(VA33_PA_S0)* 2(VA33_PAD_S0)* 3(VA1P25_RTX_S0)* 5(VA1P25_BT_SYN)* 6(VA33_BT_SYN)* 7(VA33_WL_SYN)* 8(VA1P25_WL_SYN)* 9(VA1P25_RTX_S1)* 10(VA33_PAD_S1)* 11(RFIO_BTG_S1)* 12(VA33_PA_S1)* 13(VA1P25_AFE)* 14(VA33_AFE)* 17(EEPROM_SEL/GPIO12)* 18(GPIO13)* 19(TEST_MOD_SEL/GPIO14)* 20(GPIO6)* 21(GPIO0)* 22(SPS_LDO_SEL/GPIO1)* 23(GPIO2)* 24(GPIO3)* 26(UART_CTS)* 35(SW_GND)* 36(SW_LX)* 37(VD33D)* 38(VD33D)* 45(GPIO5)* 46(GPIO4)* 47(GPIO15)*
